# Altium project Schematic_LIBRARY.PrjPcb
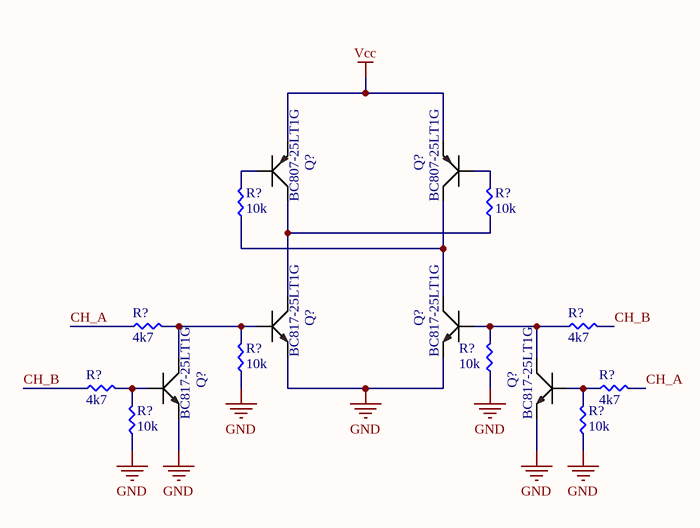
[diagram p0: H_BRIDGE_TRANSISTOR.SchDoc]
2 sheets, 25 parts. Net scope: global (net labels, ports and power ports of the same name join across sheets).
Sheets:
  H_BRIDGE_TRANSISTOR.SchDoc
  MC33063_POWER.SchDoc

## Sheet H_BRIDGE_TRANSISTOR.SchDoc
size A4; SheetNumber: 1; SheetTotal: 3

### Parts
(Parts that share a designator on the sheet are numbered #1, #2 ... from top to bottom, then left to right.)
Q?#1  BC807-25LT1G  [SOT-23]
Q?#2  BC807-25LT1G  [SOT-23]
Q?#3  BC817-25LT1G  [SOT-23]
Q?#4  BC817-25LT1G  [SOT-23]
Q?#5  BC817-25LT1G  [SOT-23]
Q?#6  BC817-25LT1G  [SOT-23]
R?#1  10k  [R_0603]
R?#2  10k  [R_0603]
R?#3  4k7  [R_0603]
R?#4  4k7  [R_0603]
R?#5  10k  [R_0603]
R?#6  10k  [R_0603]
R?#7  4k7  [R_0603]
R?#8  4k7  [R_0603]
R?#9  10k  [R_0603]
R?#10  10k  [R_0603]

### Nets
GND: Q?#3.3(Emiter) Q?#4.3(Emiter) Q?#5.3(Emiter) Q?#6.3(Emiter) R?#5.1 R?#6.1 R?#9.1 R?#10.1
Vcc: Q?#1.3(Emiter) Q?#2.3(Emiter)
CH_A: R?#3.1 R?#8.2
CH_B: R?#4.2 R?#7.1
NetQ?#1_1: Q?#1.1(Collector) Q?#3.1(Collector) R?#2.1
NetQ?#1_2: Q?#1.2(Base) R?#1.2
NetQ?#2_1: Q?#2.1(Collector) Q?#4.1(Collector) R?#1.1
NetQ?#2_2: Q?#2.2(Base) R?#2.2
NetQ?#3_2: Q?#3.2(Base) Q?#5.1(Collector) R?#3.2 R?#5.2
NetQ?#4_2: Q?#4.2(Base) Q?#6.1(Collector) R?#4.1 R?#6.2
NetQ?#5_2: Q?#5.2(Base) R?#7.2 R?#9.2
NetQ?#6_2: Q?#6.2(Base) R?#8.1 R?#10.2

### Library data of the parts
Q?#1 Q?#2 = BC807-25LT1G: TRANS PNP 45V 0.5A SOT23; Manufacturer: ON Semiconductor; Vce Saturation (Max) @ Ib, Ic: 700mV @ 50mA, 500mA; Current - Collector Cutoff (Max): 100nA (ICBO); DC Current Gain (hFE) (Min) @ Ic, Vce: 160 @ 100mA, 1V; Frequency - Transition: 100MHz; Supplier 1: Digi-Key; Manufacturer Part Number: BC807-25LT1G; RoHS: RoHS Compliant; Category: Discrete Semiconductor Products; Stock 1: 42551; Pricing 1: 1=0.16, 10=0.15, 100=0.0815, 500=0.05018, 1000=0.03421 (USD); Packaging: Cut Tape (CT); Part Status: Active; Transistor Type: PNP; Operating Temperature: -55°C ~ 150°C (TJ); Mounting Type: Surface Mount; Package / Case: TO-236-3, SC-59, SOT-23-3; Supplier Device Package: SOT-23-3 (TO-236); Base Part Number: BC807; ComponentLink1URL: http://www.onsemi.com/pub/Collateral/BC807-16LT1-D.PDF; ComponentLink1Description: http://www.onsemi.com/pub/Collateral/BC807-16LT1-D.PDF; Supplier Part Number 1: BC807-25LT1GOSCT-ND
Q?#3-Q?#6 = BC817-25LT1G: TRANS NPN 45V 0.5A SOT23; Manufacturer: ON Semiconductor; Vce Saturation (Max) @ Ib, Ic: 700mV @ 50mA, 500mA; Current - Collector Cutoff (Max): 100nA (ICBO); DC Current Gain (hFE) (Min) @ Ic, Vce: 160 @ 100mA, 1V; Frequency - Transition: 100MHz; Supplier 1: Digi-Key; Manufacturer Part Number: BC817-25LT1G; RoHS: RoHS Compliant; Category: Discrete Semiconductor Products; Stock 1: 49597; Pricing 1: 1=0.2, 10=0.185, 100=0.101, 500=0.06214, 1000=0.04237 (USD); Packaging: Cut Tape (CT); Part Status: Active; Transistor Type: NPN; Operating Temperature: -65°C ~ 150°C (TJ); Mounting Type: Surface Mount; Package / Case: TO-236-3, SC-59, SOT-23-3; Supplier Device Package: SOT-23-3 (TO-236); Base Part Number: BC817; ComponentLink1URL: http://www.onsemi.com/pub/Collateral/BC817-16LT1-D.PDF; ComponentLink1Description: http://www.onsemi.com/pub/Collateral/BC817-16LT1-D.PDF; Supplier Part Number 1: BC817-25LT1GOSCT-ND
R?#1 R?#2 R?#5 R?#6 R?#9 R?#10 = RC0603JR-0710KL: RES SMD 10K OHM 5% 1/10W 0603; Manufacturer: Yageo; Resistance: 10kR; Voltage Rating (DC): 50V; Temperature Coefficient: 100ppm/°C; Power Rating: 100mW; Number of Elements: 4; Reverse Breakdown Voltage: 6.4V; Element Configuration: Common Anode; Capacitance: 15pF; Operating Supply Voltage: 5V; Max Surge Current: 1.6A; Direction: Unidirectional; Clamping Voltage: 13V; Peak Pulse Power: 20W; Power Line Protection: No; Breakdown Voltage: 6.8V; Leakage Current: 1uA; Test Current: 1mA; Max Breakdown Voltage: 7.1V; ESD Protection: Yes; Supplier 1: Digi-Key; Manufacturer Part Number: RC0603JR-0710KL; Stock 1: 28577574; Pricing 1: 1=0.1, 10=0.02, 100=0.0081, 1000=0.00362, 2500=0.00314 (USD); Case/Package: 0603; Number of Pins: 2; Contact Plating: Matte,Tin; Case Code (Imperial): 0603; Case Code (Metric): 1608; Min Operating Temperature: -55°C; Max Operating Temperature: 155°C; Packaging: Tape and Reel; Tolerance: 5%; Composition: Thick Film; Voltage Rating: 50V; Termination: SMD/SMT; Military Standard: Not; Length: 1.6mm; Width: 0.8mm; Depth: 0.8mm; Radiation Hardening: No; REACH SVHC: Unknown; Lead Free: Lead Free; ComponentLink1URL: http://www.yageo.com/documents/recent/PYu-RC_Group_51_RoHS_L_10.pdf?src-supplier=Digi-Key; ComponentLink1Description: http://www.yageo.com/documents/recent/PYu-RC_Group_51_RoHS_L_10.pdf?src-supplier=Digi-Key; ComponentLink2URL: https://www.verical.com/server-webapp/html/getDatasheet?partID=327958&src-supplier=Verical; ComponentLink2Description: https://www.verical.com/server-webapp/html/getDatasheet?partID=327958&src-supplier=Verical; ComponentLink3URL: http://www.yageo.com/documents/recent/PYu-RC_Group_51_RoHS_L_2.pdf?src-supplier=Avnet; ComponentLink3Description: http://www.yageo.com/documents/recent/PYu-RC_Group_51_RoHS_L_2.pdf?src-supplier=Avnet; ComponentLink4URL: http://www.farnell.com/datasheets/1868787.pdf?src-supplier=Element14; ComponentLink4Description: http://www.farnell.com/datasheets/1868787.pdf?src-supplier=Element14; ComponentLink5URL: http://www.farnell.com/datasheets/443971.pdf?src-supplier=Element14; ComponentLink5Description: http://www.farnell.com/datasheets/443971.pdf?src-supplier=Element14; Supplier Part Number 1: 311-10KGRCT-ND; Supplier 2: Digi-Key; Stock 2: 19; Pricing 2: 1 = 0,35000, 10 = 0,28200, 25 = 0,25800, 100 = 0,16200, 250 = 0,16020, 500 = 0,15000, 1000 = 0,10200 (USD); RoHS: Yes; Package Quantity: 1; Number of Unidirectional Channels: 4; Reverse Standoff Voltage: 5V; Min Breakdown Voltage: 6.4V; Polarity: Unidirectional; Number of Channels: 4; Peak Pulse Current: 1.6A; Power Dissipation: 20W; Max Reverse Leakage Current: 1uA; Number of Lines: 4; Height: 1mm; Halogen Free: Halogen Free; ComponentLink6URL: https://datasheet.ciiva.com/11193/nsqa6v8aw5t2-d-11193200.pdf?src-supplier=Avnet; ComponentLink6Description: https://datasheet.ciiva.com/11193/nsqa6v8aw5t2-d-11193200.pdf?src-supplier=Avnet; ComponentLink7URL: https://datasheet.ciiva.com/15143/getdatasheetpartid-134373-15143649.pdf?src-supplier=Verical; ComponentLink7Description: https://datasheet.ciiva.com/15143/getdatasheetpartid-134373-15143649.pdf?src-supplier=Verical; ComponentLink8URL: https://datasheet.ciiva.com/339/nsqa6v8aw5t2-d-339844.pdf?src-supplier=Digi-Key; ComponentLink8Description: https://datasheet.ciiva.com/339/nsqa6v8aw5t2-d-339844.pdf?src-supplier=Digi-Key; ComponentLink9URL: https://datasheet.ciiva.com/30479/0900766b8127caf9-30479001.pdf?src-supplier=RSComponents; ComponentLink9Description: https://datasheet.ciiva.com/30479/0900766b8127caf9-30479001.pdf?src-supplier=RSComponents; ComponentLink10URL: https://datasheet.ciiva.com/339/nsqa6v8aw5t2-d-339846.pdf?src-supplier=Digi-Key; ComponentLink10Description: https://datasheet.ciiva.com/339/nsqa6v8aw5t2-d-339846.pdf?src-supplier=Digi-Key
R?#3 R?#4 R?#7 R?#8 = RC0603JR-074K7L: RES SMD 4.7K OHM 5% 1/10W 0603; Manufacturer: Yageo; Power (Watts): 0.1W, 1/10W; Temperature Coefficient: ±100ppm/°C; Supplier 1: Digi-Key; Manufacturer Part Number: RC0603JR-074K7L; RoHS: RoHS Compliant; Category: Resistors; Stock 1: 2156468; Pricing 1: 1=0.1, 10=0.025, 100=0.01, 1000=0.00451, 2500=0.00392 (USD); Packaging: Cut Tape (CT); Part Status: Active; Tolerance: ±5%; Composition: Thick Film; Features: Moisture Resistant; Operating Temperature: -55°C ~ 155°C; Package / Case: 0603 (1608 Metric); Supplier Device Package: 0603; Size / Dimension: 0.063" L x 0.032" W (1.60mm x 0.80mm); Height - Seated (Max): 0.022" (0.55mm); Failure Rate: -; ComponentLink1URL: http://www.yageo.com/documents/recent/PYu-RC_Group_51_RoHS_L_9.pdf; ComponentLink1Description: http://www.yageo.com/documents/recent/PYu-RC_Group_51_RoHS_L_9.pdf; Supplier Part Number 1: 311-4.7KGRCT-ND

## Sheet MC33063_POWER.SchDoc
size A4
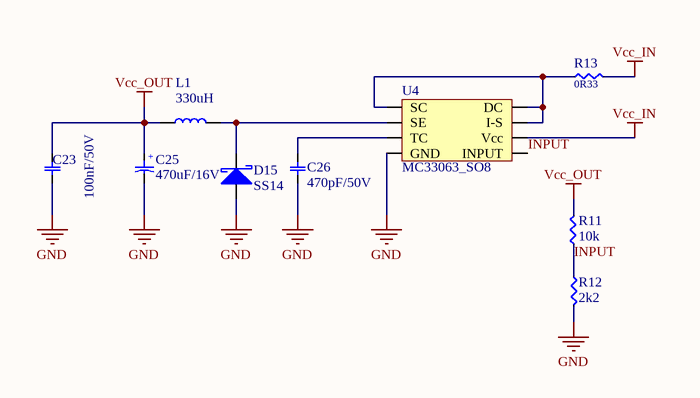
[diagram p1: MC33063_POWER.SchDoc]

### Parts
C23  100nF/50V  [Cap_0805]
C25  470uF/16V  [8x12_5mm_Cap_Dip]
C26  470pF/50V  [Cap_0805]
D15  SS14  [DO214AC(SMA)]
L1  330uH  [Inductor_7.3x7.3mm]
R11  10k  [R_0805]
R12  2k2  [R_0805]
R13  0R33  [R_0805]
U4  MC33063_SO8  [SOP8]

### Nets
GND: C23.1 C25.2 C26.1 D15.A(Anot) R12.2 U4.4(GND)
Vcc_IN: R13.2 U4.6(Vcc)
Vcc_OUT: C23.2 C25.1 L1.1 R11.2
INPUT: R11.1 R12.1 U4.5(INPUT)
NetC26_2: C26.2 U4.3(TC)
NetD15_K: D15.K(Katot) L1.2 U4.2(SE)
NetR13_1: R13.1 U4.1(SC) U4.7(I-S) U4.8(DC)

### Notes on the sheet
- (in symbol 16ZLJ470MTA8X11.5) +

### Library data of the parts
C23 = C2012X7R1H104K125AE: CAP CER nF 100 50V X7R 0805; Manufacturer: TDK Corporation; Tolerance: ±10%; Supplier 1: Digi-Key; Manufacturer Part Number: C2012X7R1H104K125AE; RoHS: RoHS Compliant; Category: Capacitors; Stock 1: 21863; Pricing 1: 1=0.29, 10=0.197, 100=0.1118, 500=0.07894, 1000=0.06907 (USD); Packaging: Cut Tape (CT); Part Status: Active; Voltage - Rated: 50V; Temperature Coefficient: X7R; Operating Temperature: -55°C ~ 125°C; Features: Soft Termination; Ratings: -; Applications: Boardflex Sensitive; Failure Rate: -; Mounting Type: Surface Mount, MLCC; Package / Case: 0805 (2012 Metric); Size / Dimension: 0.079" L x 0.049" W (2.00mm x 1.25mm); Height - Seated (Max): -; Thickness (Max): 0.057" (1.45mm); Lead Spacing: -; Lead Style: -; ComponentLink1URL: https://product.tdk.com/info/en/catalog/datasheets/mlcc_commercial_soft_en.pdf; ComponentLink1Description: https://product.tdk.com/info/en/catalog/datasheets/mlcc_commercial_soft_en.pdf; Supplier Part Number 1: 445-15929-1-ND
C25 = 16ZLJ470MTA8X11.5: CAP ALUM uF 470 16V 20% RADIAL; Manufacturer 1: Rubycon; Description 1: CAP ALUM 470UF 20% 16V RADIAL; Ripple Current (AC): 1.2A; Capacitance: 470uF; Ripple Current: 660mA; Impedance: 75mR; Life (Hours): 9000Hour; Supplier 1: Digi-Key; Manufacturer Part Number 1: 16ZLJ470MTA8X11.5; Stock 1: 22384; Pricing 1: 1=0.43, 10=0.305, 100=0.2006, 500=0.14858 (USD); Mount: Through Hole; Case/Package: Radial; Min Operating Temperature: -40°C; Max Operating Temperature: 105°C; Package Quantity: 1000; Voltage Rating: 16V; Tolerance: 20%; Packaging: Cut Tape; Voltage Rating (DC): 16V; Diameter: 8mm; Height: 11.5mm; Lead Pitch: 0.138inch; Height - Seated (Max): 0.512inch; REACH SVHC: No SVHC; ComponentLink1URL: http://www.rubycon.co.jp/en/catalog/e_pdfs/aluminum/Radial_Lead_Alumi_Eng.pdf?src-supplier=Digi-Key; ComponentLink1Description: http://www.rubycon.co.jp/en/catalog/e_pdfs/aluminum/Radial_Lead_Alumi_Eng.pdf?src-supplier=Digi-Key; ComponentLink2URL: http://www.farnell.com/datasheets/1725816.pdf?src-supplier=Element14; ComponentLink2Description: http://www.farnell.com/datasheets/1725816.pdf?src-supplier=Element14; ComponentLink3URL: http://www.rubycon.co.jp/en/catalog/e_pdfs/aluminum/e_zlj.pdf?src-supplier=Digi-Key; ComponentLink3Description: http://www.rubycon.co.jp/en/catalog/e_pdfs/aluminum/e_zlj.pdf?src-supplier=Digi-Key; Supplier Part Number 1: 1189-1549-1-ND
C26 = CC0805JRNPO9BN471: CAP CER pF 470 50V C0G/NPO 0805; Manufacturer 1: Yageo; Description 1: CAP CER 470PF 50V C0G/NPO 0805; Material: Ceramic; Capacitance: 470pF; Tolerance: 5%; Dielectric: C0G; Temperature Coefficient: 30ppm/°C; Insulation Resistance: 100GR; Supplier 1: Digi-Key; Manufacturer Part Number 1: CC0805JRNPO9BN471; Stock 1: 322742; Pricing 1: 1=0.13, 10=0.095, 100=0.0448, 500=0.03144, 1000=0.02603 (USD); Mount: Surface Mount; Case/Package: 0805; Case Code (Metric): 2012; Case Code (Imperial): 0805; Dielectric Material: Ceramic; Min Operating Temperature: -55°C; Max Operating Temperature: 125°C; Voltage Rating: 50V; Voltage Rating (DC): 50V; Package Quantity: 4000; Packaging: Tape and Reel; Termination: SMD/SMT; Composition: Ceramic; Voltage: 50V; Length: 2mm; Height: 0.6mm; Width: 0.049inch; Thickness: 0.024inch; Depth: 1.25mm; Radiation Hardening: No; REACH SVHC: Unknown; Lead Free: Lead Free; ComponentLink1URL: http://www.farnell.com/datasheets/2213336.pdf?src-supplier=Newark; ComponentLink1Description: http://www.farnell.com/datasheets/2213336.pdf?src-supplier=Newark; ComponentLink2URL: http://www.yageo.com/documents/recent/UPY-GP_NP0_16V-to-50V_16.pdf?src-supplier=Digi-Key; ComponentLink2Description: http://www.yageo.com/documents/recent/UPY-GP_NP0_16V-to-50V_16.pdf?src-supplier=Digi-Key; ComponentLink3URL: http://www.farnell.com/datasheets/1443161.pdf?src-supplier=Element14; ComponentLink3Description: http://www.farnell.com/datasheets/1443161.pdf?src-supplier=Element14; ComponentLink4URL: http://documents.rs-components.com/techlib://itc_doclist_GB.htm?stockno=6698928&src-supplier=RSComponents; ComponentLink4Description: http://documents.rs-components.com/techlib://itc_doclist_GB.htm?stockno=6698928&src-supplier=RSComponents; ComponentLink5URL: http://www.yageo.com/documents/recent/UPY-GP_NP0_16V-to-50V_8.pdf?src-supplier=Avnet+Europe; ComponentLink5Description: http://www.yageo.com/documents/recent/UPY-GP_NP0_16V-to-50V_8.pdf?src-supplier=Avnet+Europe; ComponentLink6URL: http://www.farnell.com/datasheets/2213336.pdf?src-supplier=Element14; ComponentLink6Description: http://www.farnell.com/datasheets/2213336.pdf?src-supplier=Element14; Supplier Part Number 1: 311-1119-6-ND
D15 = SS14: DIODE SCHOTTKY, SS14, 1A, 40V, SMD-ON SEMICONDUCTOR
L1 = B82472G6334M000: Inductor Power Shielded Wirewound 330uH 20% 100KHz Ferrite 330mA 1.7Ohm DCR Blister T/R; Manufacturer: TDK EPCOS; Max DC Current: 300mA; DC Resistance (DCR): 1.7R; Supplier 1: Digi-Key; Manufacturer Part Number: B82472G6334M000; Stock 1: 1390; Pricing 1: 1=1.31, 10=1.215, 100=0.8786, 500=0.67296 (USD); Case/Package: SMD/SMT; Core Material: Ferrite; Tolerance: 20%; Packaging: Tape and Reel; Shielding: Shielded; Package Quantity: 1000; Inductance: 330uH; Test Frequency: 100kHz; DC Current: 330mA; Military Standard: Not; Current Rating: 330mA; Termination: SMD/SMT; Length: 7.3mm; Height: 4.5mm; Width: 7.3mm; Depth: 7.5mm; Supplier Part Number 1: 495-5680-6-ND
R11 = RC0805JR-0710KL: RES SMD 10K OHM 5% 1/8W 0805; Manufacturer 1: Yageo; Resistance: 10kR; Power Rating: 125mW; Voltage Rating: 150V; Temperature Coefficient: 100ppm/°C; Supplier 1: Digi-Key; Manufacturer Part Number 1: RC0805JR-0710KL; Description 1: RES SMD 10K OHM 5% 1/8W 0805; Stock 1: 14124104; Pricing 1: 1=0.1, 10=0.036, 100=0.0146, 1000=0.00654, 2500=0.00568 (USD); Case/Package: 0805; Case Code (Imperial): 0805; Case Code (Metric): 2012; Contact Plating: Tin,Matte; Min Operating Temperature: -55°C; Max Operating Temperature: 155°C; Tolerance: 5%; Packaging: Tape and Reel; Termination: SMD/SMT; Composition: Thick Film; Military Standard: Not; Length: 2mm; Height: 0.5mm; Depth: 1.25mm; Width: 1.25mm; Radiation Hardening: No; REACH SVHC: Unknown; Lead Free: Lead Free; ComponentLink1URL: http://www.farnell.com/datasheets/444164.pdf?src-supplier=Element14; ComponentLink1Description: http://www.farnell.com/datasheets/444164.pdf?src-supplier=Element14; Supplier Part Number 1: 311-10KARCT-ND
R12 = RC0805JR-072K2P: RES SMD 2.2K OHM 5% 1/8W 0805; Manufacturer: Yageo; Resistance: 2.2kR; Max Power Dissipation: 125mW; Temperature Coefficient: 100ppm/°C; Supplier 1: Digi-Key; Manufacturer Part Number: RC0805JR-072K2P; RoHS: Yes; Category: Chip SMD Resistors; Stock 1: 1035; Pricing 1: 1=0,10000, 10=0,07100, 100=0,02900, 1000=0,01304, 2500=0,01132 (USD); Case/Package: 0805; Case Code (Metric): 2012; Case Code (Imperial): 0805; Min Operating Temperature: -55°C; Max Operating Temperature: 155°C; Packaging: Tape and Reel; Resistor Type: Thick Film; Number of Terminations: 2; Tolerance: 5%; Features: Moisture Resistant; Length: 0.079inch; Width: 0.049inch; Height: 0.024inch; RoHS Compliant: Yes; ComponentLink1URL: http://www.yageo.com.tw/exep/pages/download/literatures/PYu-R_INT-thick_7.pdf?src-supplier=Digi-Key; ComponentLink1Description: http://www.yageo.com.tw/exep/pages/download/literatures/PYu-R_INT-thick_7.pdf?src-supplier=Digi-Key; ComponentLink2URL: http://www.yageo.com/NewPortal/yageodocoutput?fileName=/pdf/R-Chip/PYu-RC_51_RoHS_P_0.pdf&src-supplier=Digi-Key; ComponentLink2Description: http://www.yageo.com/NewPortal/yageodocoutput?fileName=/pdf/R-Chip/PYu-RC_51_RoHS_P_0.pdf&src-supplier=Digi-Key; Supplier Part Number 1: YAG1332CT-ND
R13 = PT0805JR-070R33L: RES SMD 0.33 OHM 5% 1/8W 0805; Manufacturer 1: Yageo; Resistance: 330mR; Max Power Dissipation: 125mW; Temperature Coefficient: 100ppm/°C; Supplier 1: Digi-Key; Manufacturer Part Number 1: PT0805JR-070R33L; Description 1: RES SMD 0.33 OHM 5% 1/8W 0805; Stock 1: 0; Pricing 1: 5000=0.04556 (USD); Case/Package: 0805; Min Operating Temperature: -55°C; Max Operating Temperature: 155°C; Packaging: Tape and Reel; Composition: Thick Film; Number of Terminations: 2; Tolerance: 5%; Features: Moisture Resistant,Automotive AEC-Q200; Length: 0.079inch; Height: 0.026inch; Width: 0.049inch; Supplier Part Number 1: PT0805JR-070R33L-ND
U4 = MC33063ADG: MC33063ADG; Buck/Boost Converter 1.5A; 1.25 - 40 V; 8-Pin SOIC; Manufacturer: ON Semiconductor; Supplier 1: Allied; Manufacturer Part Number: MC33063ADG; RoHS: No; Stock 1: 775; Pricing 1: 1=0.7000, 10=0.6700, 50=0.6400, 100=0.6000, 250=0.5700 (USD); ComponentLink1URL: https://www.alliedelec.com/m/d/601cbfd53bfed888ce69fc7cc840d423.pdf; ComponentLink1Description: https://www.alliedelec.com/m/d/601cbfd53bfed888ce69fc7cc840d423.pdf; ComponentLink2URL: https://www.alliedelec.com/on-semiconductor-mc33063adg/70339981/; ComponentLink2Description: https://www.alliedelec.com/on-semiconductor-mc33063adg/70339981/; Supplier Part Number 1: 70339981

## Nets that join several sheets
GND: H_BRIDGE_TRANSISTOR (8 pins), MC33063_POWER (6 pins)